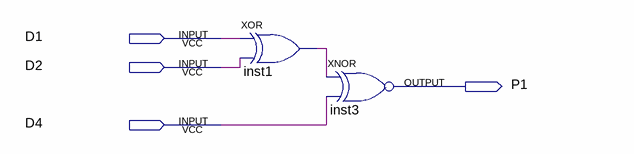
[diagram p0: schematic sheet]
// Quartus schematic generate_p1.bdf as structural Verilog: 2 symbols, 4 pins
module generate_p1 (
  input  D1,
  input  D2,
  input  D4,
  output P1
);

  wire inst1_out;

  xor inst1 (inst1_out, D1, D2);
  xnor inst3 (P1, inst1_out, D4);
endmodule
